# EAGLE design BaseShieldBrainDuino24Nov2017 (EAGLE 8.4.0)
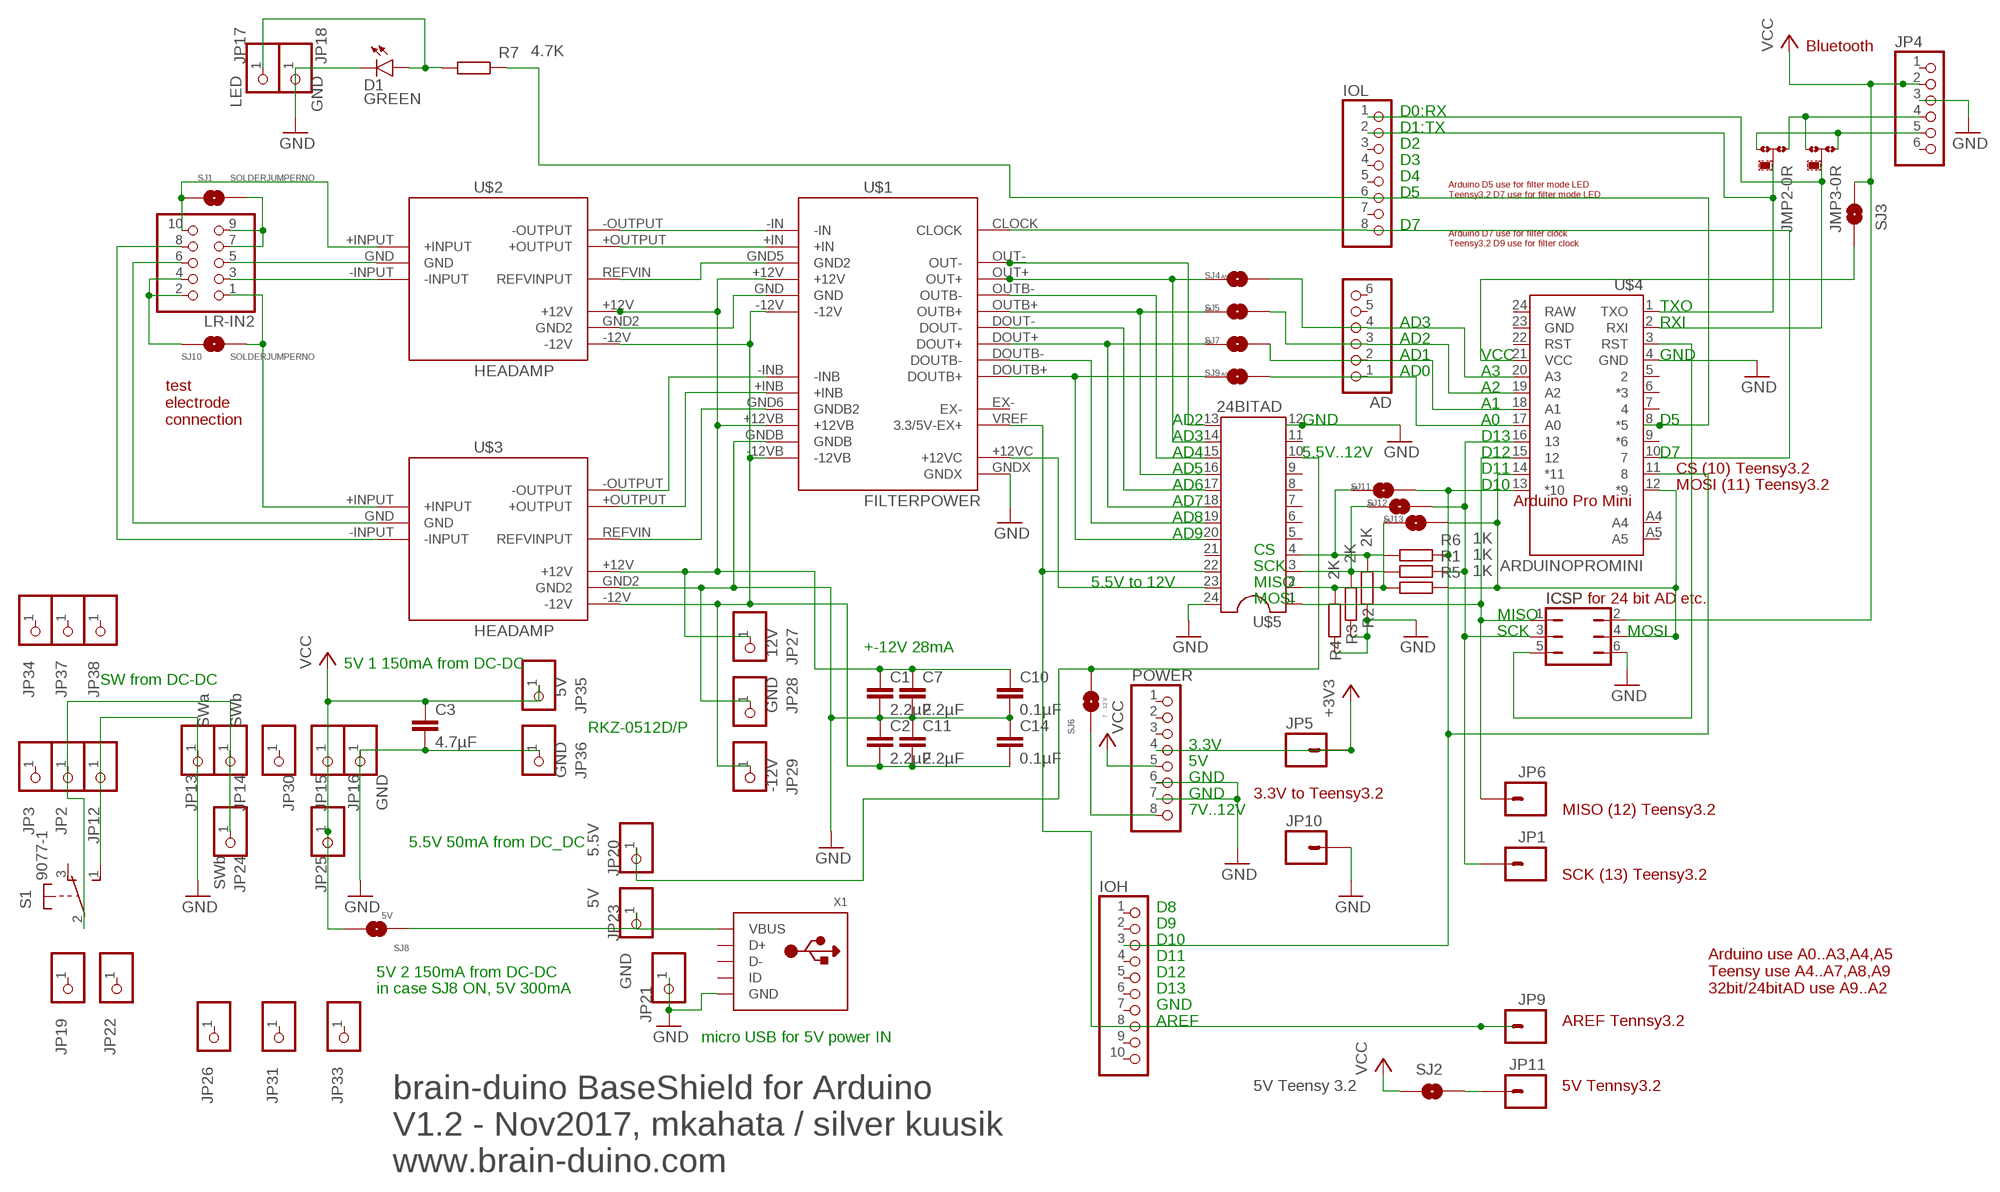
[diagram p0: schematic, sheet 1]

## Parts
AD  PINHD-1X6  [1X06]
C1  2.2µF  C-EUC0402  [C0402]
C2  2.2µF  C-EUC0402  [C0402]
C3  4.7µF  C-EUC0402  [C0402]
C7  2.2µF  C-EUC0402  [C0402]
C10  0.1µF  C-EUC0402  [C0402]
C11  2.2µF  C-EUC0402  [C0402]
C14  0.1µF  C-EUC0402  [C0402]
D1  GREEN  LED-GREEN0603  [LED-0603]
ICSP  JP3Q  [JP3Q]
IOH  PINHD-1X10  [1X10]
IOL  PINHD-1X8  [1X08]
JMP2  RX  0R-JUMPA  [A0R-JMP]
JMP3  TX  0R-JUMPA  [A0R-JMP]
JP1  M01PTH  [1X01]
JP2  PINHD-1X1  [1X01]
JP3  PINHD-1X1  [1X01]
JP4  PINHD-1X6  [1X06]
JP5  M01PTH  [1X01]
JP6  M01PTH  [1X01]
JP9  M01PTH  [1X01]
JP10  M01PTH  [1X01]
JP11  M01PTH  [1X01]
JP12  PINHD-1X1  [1X01]
JP13  SWa  PINHD-1X1  [1X01]
JP14  SWb  PINHD-1X1  [1X01]
JP15  +5V  PINHD-1X1  [1X01]
JP16  GND  PINHD-1X1  [1X01]
JP17  LED  PINHD-1X1  [1X01]
JP18  GND  PINHD-1X1  [1X01]
JP19  PINHD-1X1  [1X01]
JP20  5.5V  PINHD-1X1  [1X01]
JP21  GND  PINHD-1X1  [1X01]
JP22  PINHD-1X1  [1X01]
JP23  5V  PINHD-1X1  [1X01]
JP24  SWb  PINHD-1X1  [1X01]
JP25  +5V  PINHD-1X1  [1X01]
JP26  PINHD-1X1  [1X01]
JP27  12V  PINHD-1X1  [1X01]
JP28  GND  PINHD-1X1  [1X01]
JP29  -12V  PINHD-1X1  [1X01]
JP30  PINHD-1X1  [1X01]
JP31  PINHD-1X1  [1X01]
JP33  PINHD-1X1  [1X01]
JP34  PINHD-1X1  [1X01]
JP35  5V  PINHD-1X1  [1X01]
JP36  GND  PINHD-1X1  [1X01]
JP37  PINHD-1X1  [1X01]
JP38  PINHD-1X1  [1X01]
LR-IN2  PINHD-2X5/90  [2X05/90]
POWER  PINHD-1X8  [1X08]
R1  1K  R-EU_R0402  [R0402]
R2  2K  R-EU_R0402  [R0402]
R3  2K  R-EU_R0402  [R0402]
R4  2K  R-EU_R0402  [R0402]
R5  1K  R-EU_R0402  [R0402]
R6  1K  R-EU_R0402  [R0402]
R7  4.7K  R-EU_R0402  [R0402]
S1  9077-1  [9077-1]
SJ1  SOLDERJUMPERNO  [SJ_2S-NO]
SJ2  5V Teensy 3.2  SOLDERJUMPERNO  [SJ_2S-NO]
SJ3  5V Arduino Pro Mini  SOLDERJUMPERNO  [SJ_2S-NO]
SJ4  A5  SOLDERJUMPERNO  [SJ_2S-NO]
SJ5  A4  SOLDERJUMPERNO  [SJ_2S-NO]
SJ6  7 .. 12 V  SOLDERJUMPERNO  [SJ_2S-NO]
SJ7  A2  SOLDERJUMPERNO  [SJ_2S-NO]
SJ8  5V  SOLDERJUMPERNO  [SJ_2S-NO]
SJ9  A0  SOLDERJUMPERNO  [SJ_2S-NO]
SJ10  SOLDERJUMPERNO  [SJ_2S-NO]
SJ11  A4  SOLDERJUMPERNO  [SJ_2S-NO]
SJ12  A4  SOLDERJUMPERNO  [SJ_2S-NO]
SJ13  A4  SOLDERJUMPERNO  [SJ_2S-NO]
U$1  FILTERPOWER  [FILTERPOWER]
U$2  HEADAMP  [HEADAMP]
U$3  HEADAMP  [HEADAMP]
U$4  ARDUINOPROMINI  [ARDUINOPROMINI]
U$5  24BITAD  [24BITAD]
X1  USB_MICRO_20329_V2  [4UCONN_20329_V2]

## Nets
+3V3: JP5.1 POWER.4
+12VB: C1.1 C7.1 C10.1 JP27.1 U$1.+12V U$1.+12VB U$2.+12V U$3.+12V
-12V: C2.2 C11.2 C14.2 JP29.1 U$1.-12V U$1.-12VB U$2.-12V U$3.-12V
GND: C1.2 C2.1 C3.2 C7.2 C10.2 C11.1 C14.1 D1.C ICSP.6 JP4.3 JP10.1 JP12.1 JP13.1 JP16.1 JP18.1 JP21.1 JP28.1 JP36.1 POWER.6 POWER.7 R2.1 R3.1 R4.1 S1.1(S) U$1.GNDB U$1.GNDX U$3.GND2 U$4.4(GND) U$5.12 U$5.24 X1.BASE@1(GND) X1.BASE@2(GND) X1.GND X1.SPRT@1(GND) X1.SPRT@2(GND) X1.SPRT@3(GND) X1.SPRT@4(GND)
N$2: SJ3.1 U$4.21(VCC)
N$3: U$1.GND U$2.GND2
N$5: JP2.1 JP14.1 JP24.1 S1.2(P)
N$6: POWER.8 SJ6.1
N$7: ICSP.3 JP1.1 R1.2 SJ12.2 U$4.16
N$8: LR-IN2.8 U$3.-INPUT
N$9: JP23.1 SJ8.1 X1.VBUS
N$10: U$1.GND6(GNDB2) U$3.REFVIN(REFVINPUT)
N$12: U$1.-INB U$3.-OUTPUT
N$14: U$1.+INB U$3.+OUTPUT
N$15: LR-IN2.3 U$2.-INPUT
N$16: U$1.OUTB- U$5.15
N$17: U$1.+12VC U$5.23
N$18: U$1.OUT- U$5.13
N$19: JMP2.1 JMP3.3 JP4.4
N$20: IOL.8 U$1.CLOCK U$4.10
N$22: ICSP.1 JP6.1 U$4.15 U$5.1
N$24: IOL.2 JMP2.2 U$4.1(TXO)
N$25: U$1.-IN U$2.-OUTPUT
N$26: IOL.1 JMP3.2 U$4.2(RXI)
N$27: IOH.3 R6.2 SJ11.2 U$4.11 U$4.13(*10)
N$28: AD.2 SJ7.2 U$4.18(A1)
N$29: AD.1 SJ9.2 U$4.17(A0)
N$32: ICSP.4 R5.2 SJ13.2 U$4.12(*9) U$4.14(*11)
N$33: JMP2.3 JMP3.1 JP4.5
N$34: SJ9.1 U$1.DOUTB+ U$5.20
N$35: JP11.1 SJ2.2
N$36: JP20.1 SJ6.2 U$5.10
N$37: U$1.DOUTB- U$5.19
N$38: U$1.+IN U$2.+OUTPUT
N$39: SJ7.1 U$1.DOUT+ U$5.18
N$40: U$1.DOUT- U$5.17
N$41: IOH.8 JP9.1 U$1.VREF(3.3/5V-EX+) U$5.22
N$42: AD.4 SJ4.2 U$4.20(A3)
N$44: SJ4.1 U$1.OUT+ U$5.14
N$45: SJ5.1 U$1.OUTB+ U$5.16
N$46: LR-IN2.1 SJ10.2 U$3.+INPUT
N$47: LR-IN2.10 SJ1.1 U$2.+INPUT
N$48: LR-IN2.7 LR-IN2.9 SJ1.2
N$49: LR-IN2.2 LR-IN2.4 SJ10.1
N$51: R2.2 R6.1 SJ11.1 U$5.4
N$52: R1.1 R3.2 SJ12.1 U$5.3
N$53: R4.2 R5.1 SJ13.1 U$5.2
N$54: AD.3 SJ5.2 U$4.19(A2)
N$55: U$1.GND5(GND2) U$2.REFVIN(REFVINPUT)
N$57: LR-IN2.6 U$3.GND
N$75: ICSP.5 U$4.3(RST)
N$78: D1.A JP17.1 R7.1
N$80: IOL.6 R7.2 U$4.8(*5)
N$81: LR-IN2.5 U$2.GND
VCC: C3.1 ICSP.2 JP4.2 JP15.1 JP25.1 JP35.1 POWER.5 SJ2.1 SJ3.2 SJ8.2
Unconnected: AD.5 AD.6 IOH.1 IOH.2 IOH.4 IOH.5 IOH.6 IOH.7 IOH.9 IOH.10 IOL.3 IOL.4 IOL.5 IOL.7 JP3.1 JP4.1 JP4.6 JP19.1 JP22.1 JP26.1 JP30.1 JP31.1 JP33.1 JP34.1 JP37.1 JP38.1 POWER.1 POWER.2 POWER.3 S1.3(O) U$1.EX- U$4.5 U$4.6(*3) U$4.7 U$4.9(*6) U$4.22(RST) U$4.23(GND) U$4.24(RAW) U$4.A4 U$4.A5 U$5.5 U$5.6 U$5.7 U$5.8 U$5.9 U$5.11 U$5.21 X1.D+ X1.D- X1.ID

## Notes on the sheet
- Bluetooth
- D0:RX
- D1:TX
- D2
- D3
- D4
- D5
- Arduino D5 use for filter mode LED
  Teensy3.2 D7 use for filter mode LED
- D7
- Arduino D7 use for filter clock
  Teensy3.2 D9 use for filter clock
- TXO
- AD3 | RXI
- AD2
- AD1 | VCC | GND
- AD0 | A3
- A2
- A1
- test
  electrode
  connection
- AD2 | GND | A0 | D5
- AD3 | D13
- AD4 | 5.5V..12V | D12 | D7
- AD5 | D11 | CS (10) Teensy3.2
- AD6 | D10 | MOSI (11) Teensy3.2
- AD7 | Arduino Pro Mini
- AD8
- AD9
- CS
- SCK
- 5.5V to 12V | MISO
- MOSI | ICSP for 24 bit AD etc.
- MISO
- SCK | MOSI
- +-12V 28mA
- 5V 1 150mA from DC-DC
- SW from DC-DC
- RKZ-0512D/P | 3.3V
- 5V
- GND
- GND | 3.3V to Teensy3.2
- 7V..12V | MISO (12) Teensy3.2
- 5.5V 50mA from DC_DC
- SCK (13) Teensy3.2
- D8
- D9
- D10
- D11
- 5V 2 150mA from DC-DC | D12
- in case SJ8 ON, 5V 300mA | D13
- Arduino use A0..A3,A4,A5
  Teensy use A4..A7,A8,A9
  32bit/24bitAD use A9..A2
- GND
- AREF | AREF Tennsy3.2
- micro USB for 5V power IN
- 5V Tennsy3.2
- brain-duino BaseShield for Arduino
  V1.2 - Nov2017, mkahata / silver kuusik
  www.brain-duino.com

## Library data of the parts
AD JP4 = pinhead:PINHD-1X6: PIN HEADER
C1-C3 C7 C10 C11 C14 = rcl:C-EU: CAPACITOR, European symbol
D1 = SparkFun-LED:LED-GREEN: Various green LEDs Green LEDs used in SFE Production 0603- DIO-00821 LARGE- DIO-00862 LILYPAD- DIO-09910; PROD_ID: DIO-00821
ICSP = jumper:JP3Q: JUMPER
IOH = pinhead:PINHD-1X10: PIN HEADER
IOL POWER = pinhead:PINHD-1X8: PIN HEADER
JMP2 JMP3 = jump-0r-smd:0R-JUMP: SMD 0R 0805 Jumper
JP1 JP5 JP6 JP9-JP11 = SparkFun-Connectors:M01: Header 1 Standard 1-pin 0.1" header. Use with straight break away headers (SKU : PRT-00116), right angle break away headers (PRT-00553), swiss pins (PRT-00743), machine pins (PRT-00117), and female headers (PRT-00115). SMTSO-256-ET is a "flush mount" nut for a 4-40 screw. The older package used to be too tight, and did not allow it to sit properly thru the drill hit. The latest (0.165DIA) fits nice and snug.
JP2 JP3 JP12-JP31 JP33-JP38 = pinhead:PINHD-1X1: PIN HEADER
LR-IN2 = pinhead:PINHD-2X5: PIN HEADER
R1-R7 = resistor:R-EU_: RESISTOR, European symbol
S1 = switch-misc:9077-1: MARQUARDT SWITCH 9077.0100 Distributor: Buerklin <https://www.buerklin.com/default.asp?event=ShowArtikel%2812G2820%29&l=d&jump=ArtNr_12G2820>
SJ1-SJ13 = SparkFun-Retired:SOLDERJUMPER: Solder Jumper Standard SMD solder jumper. Used to automate production. Two varients : Normally Open and Normally Closed are the same, but have different paste layers. NC will have a large amount of paste and should jumper during reflow.
U$1 = MKH2016:FILTERPOWER
U$2 U$3 = MKH:HEADAMP: brain-duino HEADAMP
U$4 = MKH:ARDUINOPROMINI
U$5 = MKH:24BITAD
X1 = microbuilder:USB: USB Connectors USBMINIB - Surface Mount Female Mini-B USB Connector 4UConnector: 06564

## Net classes
0 default: clearance 0.205 mm

## Board
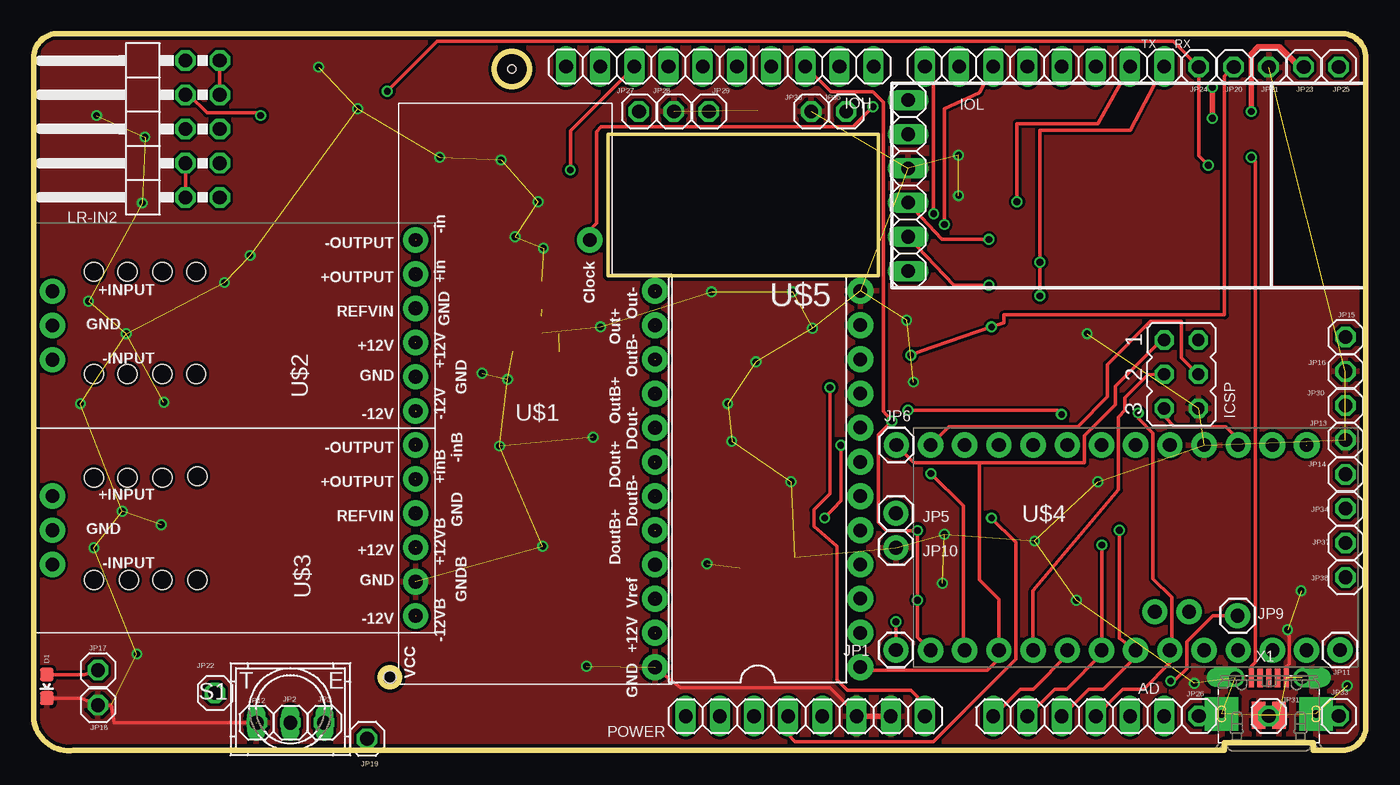
[diagram p1: board, top side]
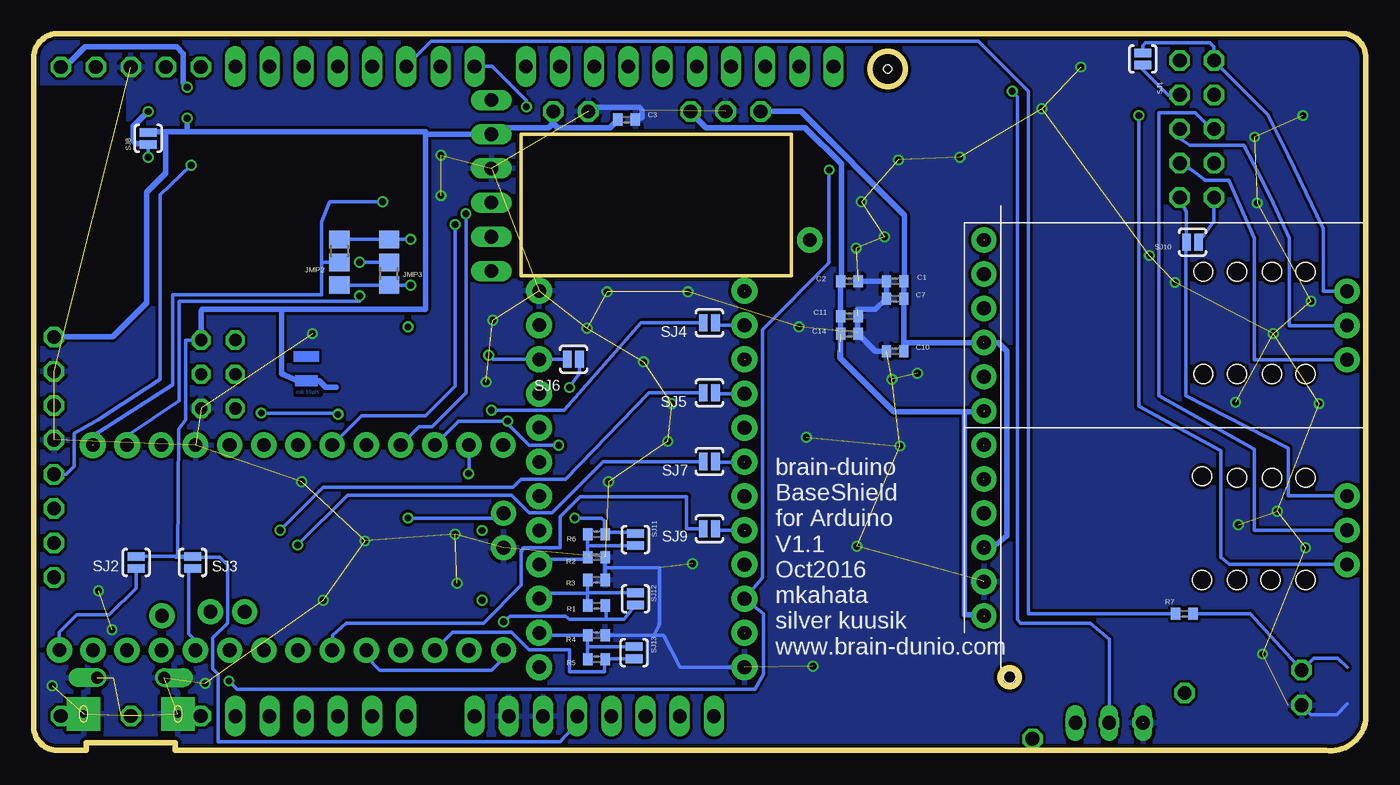
[diagram p2: board, bottom side, seen from below]

Size 98.99 x 53.26 mm. Coordinates in mm from the lower left corner, seen from the top.
Outline: 97.28,53.26 1.65,53.26 arc90 0.01,51.32 0.01,2.29 arc90 2.98,0.02 88.48,0.02 88.48,0.58 95.08,0.58 95.08,0.02 97.08,0.02 arc90 98.99,1.69
Outline: 98.99,1.7 98.99,51.32 arc90 97.31,53.26
Outline: 42.68,45.78 62.78,45.78 62.78,35.28 42.68,35.28 42.68,45.78
Outline: circle at 35.55,50.64 radius 1.3
Outline: circle at 26.48,5.46 radius 0.7
Copper layers (1*16): Top 0.035mm / dielectric 1.5mm / Bottom 0.035mm
Design rules "dirt_cheap_dirty_boards.v1": minimum track width 5mil, minimum drill 12mil, track to track 5mil, track to pad 5mil, pad to pad 5mil, via to via 5mil, smd to smd 0mil, copper to edge 10mil, drill to drill 10mil, minimum pad ring 10mil, minimum via ring 6mil, stop-mask expansion 2mil, vias tented up to drill 25mil, thermal gap 10mil
Holes 0.6 mm at 35.55,50.64
Holes 0.9 mm at 26.48,5.46
Holes 1.4 mm at 4.48,20.28 6.98,20.28 9.58,20.28 12.18,20.38 4.48,12.68 7.08,12.68 9.58,12.68 12.18,12.68 4.48,27.98 6.98,27.98 9.58,27.98 12.08,27.98 12.08,35.58 9.58,35.58 6.98,35.58 4.48,35.58
tRestrict: 4 lines
bRestrict: 4 lines

### Footprints (pad centres in the part's own frame; a part is rotated, then mirrored left to right if it is on the bottom)
1X06 = drill 1.016 long: 1 -6.35,0; 2 -3.81,0; 3 -1.27,0; 4 1.27,0; 5 3.81,0; 6 6.35,0
C0402 = smd 0.7 x 0.9: 1 -0.65,0; 2 0.65,0
LED-0603 = smd 1 x 1: A 0,-0.877; C 0,0.877
JP3Q = drill 0.914 octagon: 1 -2.54,-1.27; 2 -2.54,1.27; 3 0,-1.27; 4 0,1.27; 5 2.54,-1.27; 6 2.54,1.27
1X10 = drill 1.016 long: 1 -11.43,0; 2 -8.89,0; 3 -6.35,0; 4 -3.81,0; 5 -1.27,0; 6 1.27,0; 7 3.81,0; 8 6.35,0; 9 8.89,0; 10 11.43,0
1X08 = drill 1.016 long: 1 -8.89,0; 2 -6.35,0; 3 -3.81,0; 4 -1.27,0; 5 1.27,0; 6 3.81,0; 7 6.35,0; 8 8.89,0
A0R-JMP = smd 1.5 x 1.3: 1 0,1.7; 2 0,0; 3 0,-1.7
1X01 = drill 1.016 pad 1.88: 1 0,0
1X01' = drill 1.016 octagon: 1 0,0
2X05/90 = drill 1.016 octagon: 1 -5.08,-6.35; 2 -5.08,-3.81; 3 -2.54,-6.35; 4 -2.54,-3.81; 5 0,-6.35; 6 0,-3.81; 7 2.54,-6.35; 8 2.54,-3.81; 9 5.08,-6.35; 10 5.08,-3.81
R0402 = smd 0.7 x 0.9: 1 -0.65,0; 2 0.65,0
9077-1 = drill 0.813 long: 1 -2.54,-1.016; 2 0,-1.016; 3 2.54,-1.016
SJ_2S-NO = smd 0.635 x 1.27: 1 -0.45,0; 2 0.45,0
FILTERPOWER = drill 1.016 pad 1.88: +12V -2.54,-8.89; +12VB 12.7,-8.89; +12VC 19.05,8.89; +IN -7.62,-8.89; +INB 7.62,-8.89; -12V 2.54,-8.89; -12VB 17.78,-8.89; -IN -10.16,-8.89; -INB 5.08,-8.89; CLOCK -10.16,4.045; DOUT+ 6.35,8.89; DOUT- 3.81,8.89; DOUTB+ 11.43,8.89; DOUTB- 8.89,8.89; EX- 13.97,8.89; GND 0,-8.89; GND5 -5.08,-8.89; GND6 10.16,-8.89; GNDB 15.24,-8.89; GNDX 21.59,8.89; OUT+ -3.81,8.89; OUT- -6.35,8.89; OUTB+ 1.27,8.89; OUTB- -1.27,8.89; VREF 16.51,8.89
HEADAMP = drill 1.016 pad 1.88: +12V 1.27,12.7; +INPUT -2.54,-14.281; +OUTPUT -3.81,12.7; -12V 6.35,12.7; -INPUT 2.54,-14.281; -OUTPUT -6.35,12.7; GND 0,-14.281; GND2 3.81,12.7; REFVIN -1.27,12.7
ARDUINOPROMINI = drill 1.016 pad 1.93: 1 -7.62,16.51; 2 -7.62,13.97 | drill 1 pad 1.88: 3 -7.62,11.43 | drill 1.016 pad 1.88: 4 -7.62,8.89; 5 -7.62,6.35; 6 -7.62,3.81; 7 -7.62,1.27; 8 -7.62,-1.27; 9 -7.62,-3.81; 10 -7.62,-6.35; 11 -7.62,-8.89; 12 -7.62,-11.43; 13 7.62,-11.43; 14 7.62,-8.89; 15 7.62,-6.35; 16 7.62,-3.81; 17 7.62,-1.27; 18 7.62,1.27; 19 7.62,3.81; 20 7.62,6.35; 21 7.62,8.89; 22 7.62,11.43; 23 7.62,13.97; 24 7.62,16.51; A4 4.763,5.239; A5 4.763,7.779
24BITAD = drill 1 pad 1.93: 1 -13.97,-6.35; 2 -11.43,-6.35; 3 -8.89,-6.35; 4 -6.35,-6.35; 5 -3.81,-6.35; 6 -1.27,-6.35; 7 1.27,-6.35; 8 3.81,-6.35; 9 6.35,-6.35; 10 8.89,-6.35; 11 11.43,-6.35; 12 13.97,-6.35; 13 13.97,8.89; 14 11.43,8.89; 15 8.89,8.89; 16 6.35,8.89; 17 3.81,8.89; 18 1.27,8.89; 19 -1.27,8.89; 20 -3.81,8.89; 21 -6.35,8.89; 22 -8.89,8.89; 23 -11.43,8.89; 24 -13.97,8.89
4UCONN_20329_V2 = smd 1 x 2: BASE@1 -0.75,-2; BASE@2 0.75,-2 | smd 0.4 x 1.35: D+ 0,0.775; D- -0.65,0.775; GND 1.3,0.775; ID 0.65,0.775; VBUS -1.3,0.775 | drill 0.9 pad 1.422 offset: SPRT@1 -2.5,0.8; SPRT@2 2.5,0.8 | drill 0.56 pad 2.5 square: SPRT@3 -3.5,-1.9; SPRT@4 3.5,-1.9

### Placement (x,y rotation side)
AD  77.66,2.56 0 top
C1  34.98,34.88 180 bottom
C2  38.38,34.88 180 bottom
C3  54.93,46.88 0 bottom
C7  34.98,33.58 180 bottom
C10  34.98,29.68 180 bottom
C11  38.38,32.28 180 bottom
C14  38.38,30.98 180 bottom
D1  0.98,4.78 180 top
ICSP  85.28,27.96 270 top
IOH  50.99,50.82 180 top
IOL  75.12,50.82 180 top
JMP2  76.28,36.28 0 bottom
JMP3  72.58,36.28 180 bottom
JP1  64.08,7.48 0 top
JP2  [1X01']  19.08,2.08 0 top
JP3  [1X01']  21.58,2.08 0 top
JP4  64.98,41.98 270 top
JP5  64.08,17.63 0 top
JP6  64.11,22.7 0 top
JP9  89.46,10.02 0 top
JP10  64.08,15.08 0 top
JP11  97.08,7.48 0 top
JP12  [1X01']  16.58,2.08 0 top
JP13  SWa  [1X01']  97.48,23.08 0 top
JP14  SWb  [1X01']  97.48,20.53 0 top
JP15  +5V  [1X01']  97.48,30.73 0 top
JP16  GND  [1X01']  97.48,28.18 0 top
JP17  LED  [1X01']  4.78,5.98 0 top
JP18  GND  [1X01']  4.78,3.38 0 top
JP19  [1X01']  24.78,0.88 0 top
JP20  5.5V  [1X01']  89.18,50.78 0 top
JP21  GND  [1X01']  91.78,50.78 0 top
JP22  [1X01']  13.48,4.28 0 top
JP23  5V  [1X01']  94.38,50.78 0 top
JP24  SWb  [1X01']  86.58,50.78 0 top
JP25  +5V  [1X01']  96.98,50.78 0 top
JP26  [1X01']  86.58,2.58 0 top
JP27  12V  [1X01']  44.98,47.48 0 top
JP28  GND  [1X01']  47.58,47.48 0 top
JP29  -12V  [1X01']  50.18,47.48 0 top
JP30  [1X01']  97.48,25.63 0 top
JP31  [1X01']  91.78,2.58 0 top
JP33  [1X01']  96.98,2.58 0 top
JP34  [1X01']  97.48,17.98 0 top
JP35  5V  [1X01']  60.38,47.48 0 top
JP36  GND  [1X01']  57.78,47.48 0 top
JP37  [1X01']  97.48,15.43 0 top
JP38  [1X01']  97.48,12.88 0 top
LR-IN2  7.48,46.18 90 top
POWER  57.34,2.56 0 top
R1  57.18,10.78 0 bottom
R2  57.18,14.38 180 bottom
R3  57.18,12.68 180 bottom
R4  57.18,8.58 180 bottom
R5  57.18,6.78 0 bottom
R6  57.18,16.08 0 bottom
R7  13.48,10.18 180 bottom
S1  19.08,3.08 0 top
SJ1  16.58,51.38 270 bottom
SJ2  91.38,13.98 270 bottom
SJ3  87.18,13.98 90 bottom
SJ4  48.78,31.78 180 bottom
SJ5  48.78,26.58 180 bottom
SJ6  58.88,29.08 180 bottom
SJ7  48.78,21.48 180 bottom
SJ8  90.48,45.48 90 bottom
SJ9  48.78,16.48 180 bottom
SJ10  12.88,37.78 180 bottom
SJ11  54.28,15.68 90 bottom
SJ12  54.28,11.28 270 bottom
SJ13  54.38,7.28 270 bottom
U$1  37.28,27.78 270 top
U$2  15.68,31.58 270 top
U$3  15.68,16.38 270 top
U$4  78.08,15.08 270 top
U$5  55.08,20.18 90 top
X1  91.78,4.63 0 top

### Tracks (layer width: path | path; a pad name or v marks a point on that pad's centre or on a via)
+3V3  (via drill 0.5)
  Top 0.254: POWER.4 56.08,1.18 56.58,0.68 66.88,0.68 73,6.78 72.98,15.48 v71.18,17.28
  Bottom 0.254: v71.18,17.28 64.13,17.28 JP5.1
+12VB  (2 unrouted)
  Bottom 0.254: 34.23,34.98 C1.1
  Bottom 0.406: U$1.+12VB 27.38,15.38 26.68,15.98 26.68,29.68 27.31,30.31 U$2.+12V 34.31,30.31 34.33,30.33 C10.1 C7.1 C1.1 34.28,34.93 34.28,39.78 41.98,47.48 JP27.1
-12V  (4 unrouted)
  Bottom 0.254: 28.41,10.08 U$1.-12VB | 38.98,34.93 C2.2
  Bottom 0.406: 29.83,25.18 29.83,10.08 28.41,10.08 | 38.98,34.93 38.98,43.58 41.68,46.28 49.03,46.28 50.18,47.43 JP29.1 | 28.38,25.18 29.83,25.18 | C11.2 C14.2 | 39.08,29.18 39.08,29.63 | 39.08,29.18 35.08,25.18 29.83,25.18 | C2.2 39.03,29.23 39.08,29.18
GND  (via drill 0.5)  (72 unrouted)
  Top 0.254: 86.61,25.48 ICSP.6 | POWER.6 61.15,2.71 59.18,4.68 48.08,4.68 46.27,6.09 U$1.GNDX | JP12.1 5.98,2.08 5.78,3.38 JP18.1 3.55,3.9 D1.C | X1.GND 93.08,6.23 93.32,6.47 93.32,8.44 v93.18,8.98
  Top 0.406: POWER.7 POWER.6
  Bottom 0.254: 56.53,13.58 52.48,13.58 52.48,9.38 | 52.48,9.38 52.88,8.58 R4.1 52.18,8.58 50.98,6.18 U$1.GNDX | 52.53,9.43 52.48,9.38 | 1.38,3.48 2.18,2.68 4.08,2.68 JP18.1 | R3.1 56.53,13.58 | 56.53,13.58 R2.1
  Bottom 0.406: JP36.1 57.28,47.78 53.98,47.78 53.78,47.58 53.78,47.03 C3.2 | C2.1 C1.2 C7.2 36.43,32.78 37.78,32.78 37.78,31.03 C14.1 36.43,29.68 C10.2
  other vias: 41.08,6.28 56.38,34.08 67.68,16.08 41.58,23.28 51.58,25.78 50.38,34.08 50.03,13.88 86.24,5 51.88,22.98 37.83,15.18 3.48,25.78 67.53,12.43 57.88,31.38 94.18,11.88 4.48,15.08 97.62,4.83 9.48,16.78 9.68,25.88 7.68,7.18 65.38,27.38 64.88,31.98 30.18,44.08 74.38,15.58 4.68,47.18 21.18,50.78 24.08,47.68 8.28,45.58 8.08,40.68 53.68,28.88 56.28,19.98 77.48,11.18 79.08,19.98 14.18,34.78 6.88,30.98 4.08,33.38 6.58,17.78 37.48,40.78 34.63,22.63 16.08,36.78 78.28,30.98 68.73,44.23 68.73,41.23 35.78,38.18 37.88,37.33 33.33,28.03 35.23,27.58 34.73,43.88 42.13,31.48
  pour Top: 0.01,53.26 0.01,0.02 98.99,0.02 98.99,53.26
  pour Bottom: 0.01,53.26 0.01,0.02 98.99,0.02 98.99,53.26
N$2
  Bottom 0.254: U$4.21 86.97,8.17 87.48,8.68 87.48,13.23 SJ3.1
N$3  (1 unrouted)
N$5  (via drill 0.5)
  Top 0.254: JP2.1 S1.2 | v87.28,43.48 86.58,44.18 JP24.1 84.68,52.68 29.98,52.68 v26.28,48.98
  Bottom 0.254: JP14.1 96.58,20.53 95.98,21.13 95.98,23.58 94.18,24.58 89.58,27.58 89.58,41.28 v87.28,43.48 | JP2.1 19.08,8.28 20.48,9.48 25.68,9.48 25.88,9.78 25.88,48.58 v26.28,48.98
N$6  (via drill 0.5)
  Top 0.254: 66.18,2.61 POWER.8 66.28,2.61 66.28,3.38 65.18,4.48 60.48,4.48 59.68,5.28 59.68,15.18 57.98,16.68 57.98,17.88 59.18,19.08 v59.18,26.98
  Bottom 0.254: SJ6.1 58.43,28.03 59.08,27.18 v59.18,26.98 | 66.28,2.61 POWER.8
N$7  (via drill 0.5)
  Top 0.254: U$4.16 74.27,11.87 80.62,19.38 80.62,24.78 81.08,25.28 81.08,26.23 82.78,27.93 ICSP.3 | v64.08,9.58 JP1.1
  Bottom 0.254: v64.08,9.58 63.58,9.98 59.48,9.98 59.18,9.78 56.48,9.78 | 56.48,9.78 56.48,10.53 R1.2 | U$4.16 74.27,6.97 73.28,5.98 64.98,5.98 64.08,6.88 JP1.1 | 56.48,9.78 55.13,9.78 SJ12.2
N$8  (via drill 0.5)
  Top 0.254: LR-IN2.8 11.54,48.72 12.88,47.38 16.58,47.38 v16.88,47.18
  Bottom 0.254: v16.88,47.18 16.88,25.58 10.78,22.28 10.78,14.38 10.14,13.84 U$3.-INPUT
N$9  (via drill 0.5)
  Top 0.254: X1.VBUS 90.48,6.28 90.77,6.58 90.77,43.78 v90.48,44.08
  Top 0.406: JP23.1 94.08,50.78 92.58,52.28 90.98,52.28 90.48,51.78 v90.48,47.48
  Bottom 0.254: v90.48,44.08 SJ8.1
  Bottom 0.406: v90.48,47.48 91.58,46.38 91.58,45.28 91.38,45.08 90.53,45.08 SJ8.1
N$10  (1 unrouted)
N$12  (1 unrouted)
N$14  (1 unrouted)
N$15
  Bottom 0.254: U$2.-INPUT 8.28,29.04 8.28,38.08 10.18,42.38 11.98,42.38 12.08,42.48 12.87,43.08 LR-IN2.3
N$16  (1 unrouted)
N$17  (1 unrouted)
N$18  (1 unrouted)
N$19  (via drill 0.5)
  Top 0.254: v70.98,37.98 67.51,37.98 JP4.4
  Bottom 0.254: JMP2.1 JMP3.3 v70.98,37.98
N$20  (via drill 0.5)
  Top 0.254: v66.88,39.88 66.88,50.17 IOL.8 | U$1.CLOCK 41.32,38.68 41.83,39.18 41.83,45.98 42.18,46.33 60.88,46.33 v62.38,47.83
  Bottom 0.254: v66.88,39.88 66.88,26.58 69.38,24.08 70.35,24.08 U$4.10 | IOL.8 64.93,50.83 62.38,48.28 v62.38,47.83
N$22
  Top 0.254: ICSP.1 83.79,30.48 83.78,30.48 80.38,27.08 80.38,25.68 78.08,23.38 78.08,21.38 70.28,21.38 | 70.28,21.38 70.28,12.68 71.73,11.23 U$4.15 71.73,6.83 70.88,5.98 61.66,5.98 U$5.1 | 70.28,21.38 65.43,21.38 JP6.1
N$24  (via drill 0.5)  (1 unrouted)
  Top 0.254: IOL.2 80.27,48.67 79.08,46.58 73.08,46.58 v73.07,40.77
  Bottom 0.254: 77.58,36.28 77.58,33.88 88.68,33.88 88.68,27.18 94.58,23.38 U$4.1 | JMP2.2 77.58,36.28 | 77.58,36.28 77.58,39.28 76.99,40.77 v73.07,40.77
N$25  (1 unrouted)
N$26  (via drill 0.5)
  Top 0.254: v74.78,33.78 v74.78,36.28 74.78,46.08 81.48,46.08 83.98,50.79 IOL.1
  Bottom 0.254: JMP3.2 v74.78,36.28 | v74.78,33.78 74.78,33.38 88.18,33.38 88.18,25.98 92.05,23.41 U$4.2
N$27  (via drill 0.5)
  Top 0.254: U$4.13 65.68,8.43 v65.68,11.18 v65.68,16.35 63.38,16.35 62.78,16.95 62.78,23.48 v63.78,24.48 63.13,25.23 63.13,48.18 62.38,48.93 59.23,48.93 IOH.3 | v59.98,22.68 59.98,18.58 v58.78,17.28
  Bottom 0.254: v59.98,22.68 62.18,22.68 63.78,24.28 v63.78,24.48 67.41,24.48 U$4.11 | R6.2 56.48,15.98 56.48,16.23 | 56.48,16.23 R6.2 | 56.48,16.23 54.38,16.23 SJ11.2 | v58.78,17.28 56.78,17.28 56.58,17.08 56.58,16.13 R6.2
N$28  (via drill 0.5)
  Top 0.254: v79.38,15.28 79.38,7.19 U$4.18 79.35,7.15 76.78,4.58 75.87,4.58 AD.2
  Bottom 0.254: SJ7.2 56.68,21.48 60.48,17.68 62.18,17.68 63.48,18.98 75.68,18.98 v79.38,15.28
N$29
  Top 0.254: U$4.17 76.81,7.11 74.28,4.58 73.33,4.58 AD.1
  Bottom 0.254: SJ9.2 50.48,16.48 50.48,18.88 58.38,18.88 59.88,17.38 59.88,15.08 62.58,15.08 62.78,14.78 62.78,12.28 65.58,9.48 75.78,9.48 76.78,8.58 76.78,8.53 U$4.17
N$32  (via drill 0.5)
  Top 0.254: v66.68,20.58 69.08,18.18 69.08,7.57 U$4.14 | ICSP.4 86.5,27.96 85.28,29.18 85.28,31.88 82.98,31.88 79.78,28.68 79.78,26.28 77.58,24.08 68.03,24.08 U$4.12
  Bottom 0.254: U$4.14 67.87,8.78 63.48,8.78 62.18,7.48 59.18,7.48 59.18,5.88 56.58,5.88 56.58,6.73 R5.2 56.48,6.83 SJ13.2 | U$4.12 66.65,20.61 v66.68,20.58
N$33  (via drill 0.5)
  Top 0.254: v70.98,34.58 68.37,34.58 JP4.5
  Bottom 0.254: JMP2.3 JMP3.1 v70.98,34.58
N$34  (1 unrouted)
  Bottom 0.254: U$5.20 48.32,16.37 SJ9.1
N$35
  Bottom 0.254: SJ2.2 91.38,12.08 93.38,10.08 95.78,10.08 97.08,8.78 JP11.1
N$36  (via drill 0.5)
  Top 0.254: v65.18,29.38 65.88,29.68 v71.18,31.48 72.08,31.78 72.08,32.38 88.48,32.38 88.48,50.08 JP20.1
  Bottom 0.254: v65.18,29.38 64.84,29.08 U$5.10 SJ6.2
N$37  (1 unrouted)
N$38  (1 unrouted)
N$39  (1 unrouted)
  Bottom 0.254: U$1.DOUT+ 48.28,21.43 SJ7.1
N$40  (1 unrouted)
N$41  (via drill 0.5)  (1 unrouted)
  Top 0.254: v84.48,5.18 84.78,5.18 85.68,6.08 85.68,8.08 87.62,10.02 JP9.1 | IOH.8 39.88,46.06 v39.88,43.13
  Bottom 0.254: v84.48,5.18 83.88,4.58 45.38,4.58 44.78,5.68 44.78,10.18 U$1.VREF 44.83,12.86 44.83,31.28 39.88,36.23 v39.88,43.13
N$42  (via drill 0.5)
  Top 0.254: v64.98,25.28 76.08,25.28 v76.38,24.98 | v82.08,25.08 82.08,24.68 83.16,23.58 83.18,12.78 84.58,11.38 84.58,7.61 U$4.20 84.43,6.53 82.48,4.58 80.95,4.58 AD.4
  Bottom 0.254: SJ4.2 53.88,31.78 59.58,25.28 v64.98,25.28 | v76.38,24.98 76.48,25.08 v82.08,25.08
N$44  (1 unrouted)
  Bottom 0.254: U$5.14 48.3,31.61 SJ4.1
N$45  (1 unrouted)
  Bottom 0.254: U$5.16 48.38,26.53 SJ5.1
N$46
  Bottom 0.254: U$3.+INPUT 5.78,18.92 5.78,22.48 13.38,26.38 13.38,38.13 SJ10.2 13.33,40 LR-IN2.1
N$47
  Bottom 0.254: SJ1.1 16.58,52.38 16.38,52.58 11.58,52.58 11.29,52.29 LR-IN2.10 7.28,47.25 5.78,44.18 3.18,38.78 3.18,34.12 U$2.+INPUT
N$48
  Top 0.254: LR-IN2.7 LR-IN2.9
  Bottom 0.254: SJ1.2 16.58,50.58 14.68,48.68 13.87,48.68 LR-IN2.7
N$49
  Top 0.254: LR-IN2.4 LR-IN2.2
  Bottom 0.254: LR-IN2.2 11.29,39.32 SJ10.1
N$51
  Bottom 0.254: 57.83,15.28 R2.2 57.88,14.23 61.03,14.23 U$5.4 | 57.83,15.28 R6.1 | SJ11.1 57.78,15.23 57.83,15.28
N$52
  Bottom 0.254: 57.84,10.59 R1.1 | R1.1 | R3.2 57.83,11.68 | 57.83,11.68 R1.1 | SJ12.1 57.78,11.73 57.83,11.68 | 57.83,11.68 61.04,11.68 U$5.3
N$53
  Bottom 0.254: U$5.2 61.13,8.58 R4.2 57.83,7.68 | SJ13.1 57.78,7.73 57.83,7.68 | 57.83,7.68 R5.1
N$54  (via drill 0.5)
  Top 0.254: v80.68,16.38 80.68,8.37 U$4.19 81.89,6.99 79.48,4.58 78.41,4.58 AD.3
  Bottom 0.254: SJ5.2 53.28,26.58 59.48,20.18 62.78,20.18 63.38,19.58 77.48,19.58 v80.68,16.38
N$55  (1 unrouted)
N$57
  Bottom 0.254: LR-IN2.6 11.48,46.18 12.68,47.38 15.38,47.38 15.38,26.38 8.28,22.38 8.28,16.38 U$3.GND
N$59
  Bottom 0: 95.08,-0.02 95.18,-0.02
N$75
  Top 0.254: ICSP.5 84.01,24.85 84.78,24.08 88.58,24.08 89.48,23.18 89.48,23.13 U$4.3
N$78
  Top 0.254: D1.A 3.75,5.66 JP17.1
  Bottom 0.254: R7.1 8.58,10.18 JP17.1 3.88,6.88 2.08,6.88 1.38,6.18
N$80  (via drill 0.5)
  Top 0.254: v67.68,39.08 67.68,47.68 70.28,48.88 71.28,50.79 IOL.6
  Bottom 0.254: v67.68,39.08 67.68,27.08 69.88,24.88 74.63,24.88 U$4.8 | R7.2 25.08,10.18 25.08,48.98 28.78,52.68 69.48,52.68 71.31,50.85 IOL.6
N$81
  Bottom 0.254: U$2.GND 5.68,31.58 5.68,38.08 7.08,41.08 8.28,43.48 9.08,44.98 13.08,44.98 13.88,45.48 13.88,46.13 LR-IN2.5
VCC  (via drill 0.5)
  Top 0.406: v87.58,49.28 v87.58,46.98
  Bottom 0.254: SJ2.1 88.48,14.43 | 88.48,14.43 88.28,14.43 | 88.28,14.43 SJ3.2 | 88.28,14.43 88.23,23.88 87.68,24.58 87.68,30.48 86.57,30.48 ICSP.2 | POWER.5 58.61,2.05 59.88,0.68 85.28,0.68 85.28,5.68 85.68,6.08 85.68,8.38 84.58,9.48 84.58,13.78 85.18,14.38 88.43,14.38 88.48,14.43 | 77.78,27.48 79.38,27.48
  Bottom 0.406: 69.88,45.58 69.88,32.78 80.58,32.78 | ICSP.2 86.55,32.61 86.48,32.78 80.58,32.78 | 80.58,32.78 80.58,27.98 79.38,27.48 | 77.78,27.48 77.28,26.98 76.53,26.98 | 87.68,45.98 69.88,45.98 69.88,45.58 | 87.68,45.98 89.18,45.98 | 97.48,30.77 JP15.1 93.13,30.73 90.58,33.28 90.58,41.48 89.18,42.88 89.18,45.98 | 69.88,45.58 69.87,45.79 JP4.2 64.49,46.28 60.73,46.28 60.38,46.63 JP35.1 60.38,46.58 60.08,46.28 56.18,46.28 C3.1 | JP25.1 96.68,50.78 95.18,52.28 88.38,52.28 87.88,51.78 87.88,49.58 v87.58,49.28 | 89.18,45.98 90.53,45.98 SJ8.2 | v87.58,46.98 87.58,46.08 87.68,45.98
(copper drawn outside any net)
  shapes: Bottom area x2

### Text on the board
Bottom: coli 10µH
tNames: TX | RX
bNames: brain-duino / BaseShield / for Arduino / V1.1 / Oct2016 / mkahata / silver kuusik / www.brain-dunio.com